# Altium schematic sheet [04]Power Supplies.SchDoc
size A4; Organization: Altium Limited; Address1: L3, 12a Rodborough Rd; Address2: Frenchs Forest; Address3: NSW; Address4: Australia 2086
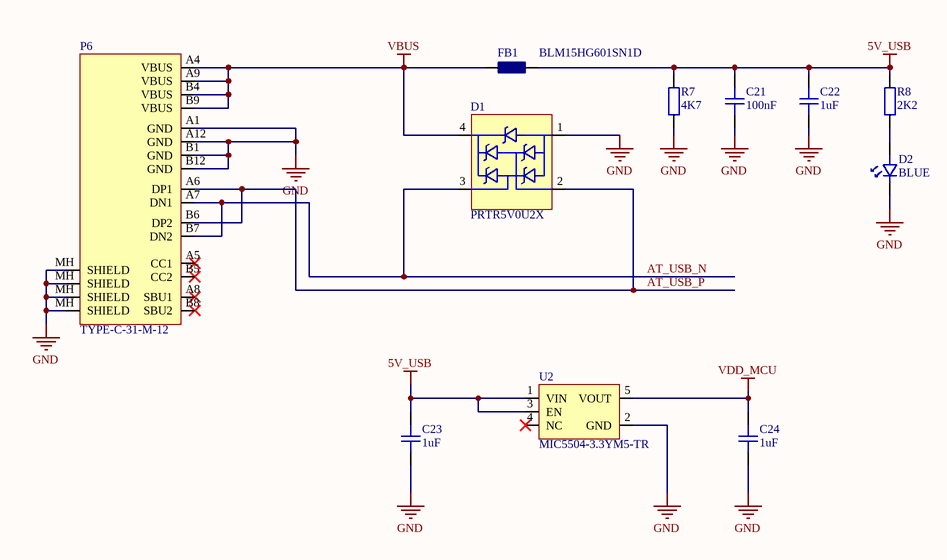
[diagram p0: [04]Power Supplies.SchDoc]

## Parts
C21  100nF  [CAPC1005L]
C22  1uF  [CAPC1005L]
C23  1uF  [CAPC1005L]
C24  1uF  [CAPC1005L]
D1  PRTR5V0U2X  [SOT143L]
D2  BLUE  [LEDC1608L]
FB1  BLM15HG601SN1D  [FBDC1005L]
P6  TYPE-C-31-M-12  [TYPE-C-31-M-12]
R7  4K7  [RESC1005L]
R8  2K2  [RESC1005L]
U2  MIC5504-3.3YM5-TR  [SOT23-5_L]

## Nets
5V_USB: C21.2 C22.2 C23.2 FB1.2 R7.2 R8.1 U2.1(VIN) U2.3(EN)
GND: C21.1 C22.1 C23.1 C24.1 D1.1 D2.1 P6.A1(GND) P6.A12(GND) P6.B1(GND) P6.B12(GND) P6.MH(SHIELD) R7.1 U2.2(GND)
VBUS: D1.4 FB1.1 P6.A4(VBUS) P6.A9(VBUS) P6.B4(VBUS) P6.B9(VBUS)
VDD_MCU: C24.2 U2.5(VOUT)
AT_USB_N: D1.3 P6.A7(DN1) P6.B7(DN2)
AT_USB_P: D1.2 P6.A6(DP1) P6.B6(DP2)
NetD2_2: D2.2 R8.2

Not connected (* = marked no-connect by the designer): P6 A5(CC1)* A8(SBU1)* B5(CC2)* B8(SBU2)*; U2 4(NC)*

## Notes on the sheet
- Title
- Size:
- Date:
- A4
- Number:
- Time:
- Revision:
- Sheet
- of
- File:

## Library data of the parts
C21-C24 = CAP_CHP: Surface Mount Unpolarized Capacitor
D1 = PRTR5V0U2X: Ultra low capacitance double rail-to-rail ESD protection diode
D2 = LED_SMD: Surface Mount LED
FB1 = FBD_CHP: Surface Mount Ferrite Bead
P6 = TYPE-C-31-M-12: USB Type-C Connector
R7 R8 = RES_CHP: Surface Mount Resistor
U2 = MIC5504-3.3YM5-TR: Linear Voltage Regulator Positive Fixed 1 Output 3.3V 300mA SOT-23-5